# EAGLE schematic lh (EAGLE 6.4)
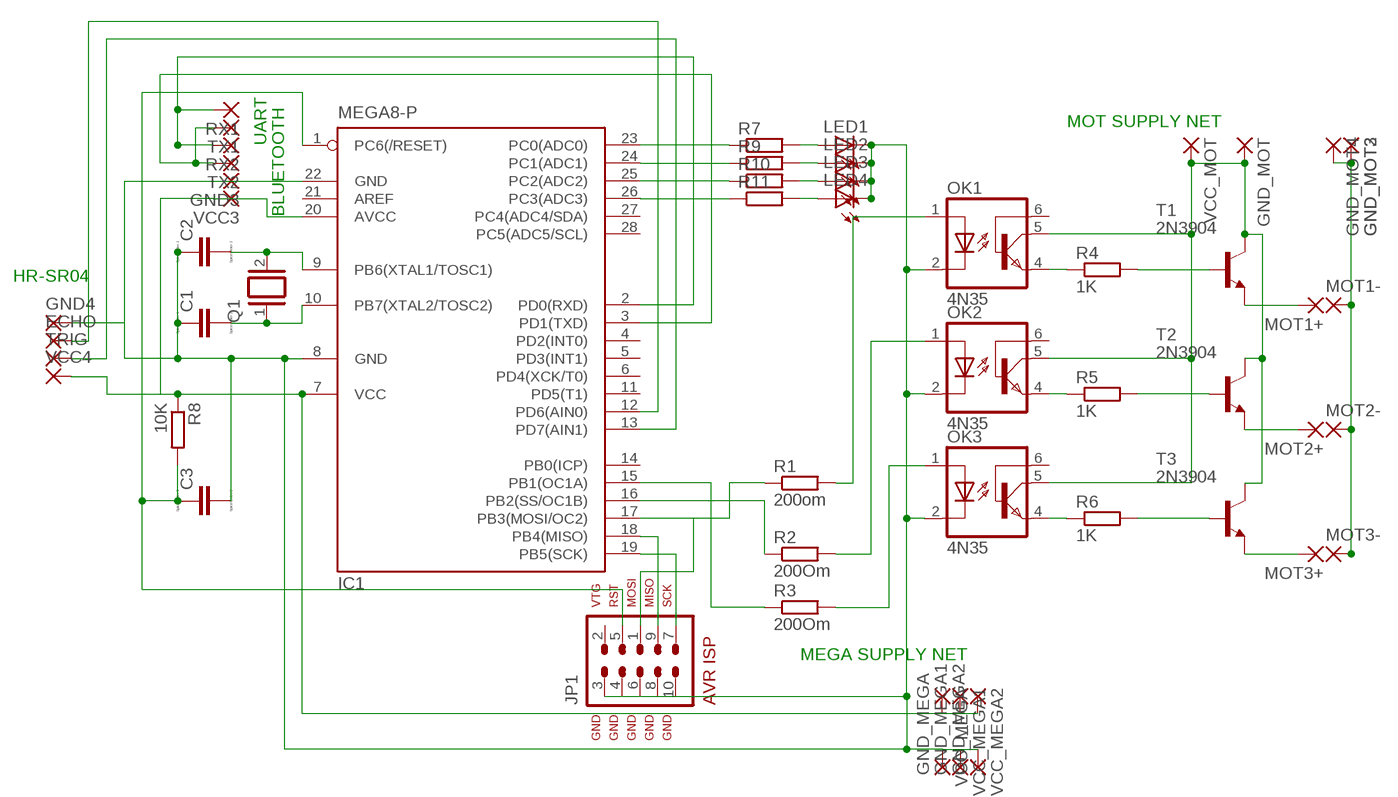
[diagram p0: schematic, sheet 1]

## Parts
C1  CC1206  [C1206]
C2  CC1206  [C1206]
C3  CC1206  [C1206]
ECHO  1,6/0,8  [1,6/0,8]
GND3  1,6/0,8  [1,6/0,8]
GND4  1,6/0,8  [1,6/0,8]
GND_MEGA  1,6/0,8  [1,6/0,8]
GND_MEGA1  1,6/0,8  [1,6/0,8]
GND_MEGA2  1,6/0,8  [1,6/0,8]
GND_MOT  1,6/0,8  [1,6/0,8]
GND_MOT2  1,6/0,8  [1,6/0,8]
GND_MOT3  1,6/0,8  [1,6/0,8]
GND_MOT4  1,6/0,8  [1,6/0,8]
IC1  MEGA8-P  [DIL28-3]
JP1  AVR-ISP-10  [AVR-ISP-10]
LED1  LEDSML0603  [SML0603]
LED2  LEDSML0603  [SML0603]
LED3  LEDSML0603  [SML0603]
LED4  LEDSML0603  [SML0603]
MOT1+  1,6/0,8  [1,6/0,8]
MOT1-  1,6/0,8  [1,6/0,8]
MOT2+  1,6/0,8  [1,6/0,8]
MOT2-  1,6/0,8  [1,6/0,8]
MOT3+  1,6/0,8  [1,6/0,8]
MOT3-  1,6/0,8  [1,6/0,8]
OK1  4N35  [DIL06]
OK2  4N35  [DIL06]
OK3  4N35  [DIL06]
Q1  XTAL/S  [QS]
R1  200om  R-EU_R0603  [R0603]
R2  200Om  R-EU_R0603  [R0603]
R3  200Om  R-EU_R0603  [R0603]
R4  1K  R-EU_R0603  [R0603]
R5  1K  R-EU_R0603  [R0603]
R6  1K  R-EU_R0603  [R0603]
R7  R-EU_R0603  [R0603]
R8  10K  R-EU_R0603  [R0603]
R9  R-EU_R0603  [R0603]
R10  R-EU_R0603  [R0603]
R11  R-EU_R0603  [R0603]
RX1  1,6/0,8  [1,6/0,8]
RX2  1,6/0,8  [1,6/0,8]
T1  2N3904  [TO92]
T2  2N3904  [TO92]
T3  2N3904  [TO92]
TRIG  1,6/0,8  [1,6/0,8]
TX1  1,6/0,8  [1,6/0,8]
TX2  1,6/0,8  [1,6/0,8]
VCC3  1,6/0,8  [1,6/0,8]
VCC4  1,6/0,8  [1,6/0,8]
VCC_MEGA  1,6/0,8  [1,6/0,8]
VCC_MEGA1  1,6/0,8  [1,6/0,8]
VCC_MEGA2  1,6/0,8  [1,6/0,8]
VCC_MOT  1,6/0,8  [1,6/0,8]

## Nets
MEGA_GND: C1.1 C2.1 C3.2 GND3.1(P) GND4.1(P) GND_MEGA1.1(P) GND_MEGA2.1(P) GND_MEGA.1(P) IC1.8(GND) IC1.22(GND) JP1.3 JP1.4 JP1.6 JP1.8 JP1.10 LED1.C LED2.C LED3.C LED4.C OK1.2(C) OK2.2(C) OK3.2(C)
MEGA_VCC: IC1.7(VCC) IC1.20(AVCC) R8.1 VCC3.1(P) VCC4.1(P) VCC_MEGA1.1(P) VCC_MEGA2.1(P) VCC_MEGA.1(P)
MOTO_GND: GND_MOT2.1(P) GND_MOT3.1(P) GND_MOT4.1(P) MOT1-.1(P) MOT2-.1(P) MOT3-.1(P)
MOTO_VCC: GND_MOT.1(P) OK1.5(COL) OK2.5(COL) OK3.5(COL) T1.1(C) T2.1(C) T3.1(C) VCC_MOT.1(P)
N$1: IC1.17(PB3(MOSI/OC2)) R1.1
N$2: IC1.16(PB2(SS/OC1B)) R2.1
N$3: JP1.1
N$4: OK1.1(A) R1.2
N$5: OK2.1(A) R2.2
N$6: OK3.1(A) R3.2
N$7: OK1.4(EMI) R4.1
N$8: OK2.4(EMI) R5.1
N$9: OK3.4(EMI) R6.1
N$10: R6.2 T3.2(B)
N$11: IC1.23(PC0(ADC0)) R7.1
N$13: MOT1+.1(P) T1.3(E)
N$14: MOT2+.1(P) T2.3(E)
N$15: MOT3+.1(P) T3.3(E)
N$16: C2.2 IC1.9(PB6(XTAL1/TOSC1)) Q1.2
N$17: C1.2 IC1.10(PB7(XTAL2/TOSC2)) Q1.1
N$18: IC1.19(PB5(SCK)) JP1.7
N$19: IC1.18(PB4(MISO)) JP1.9
N$20: R4.2 T1.2(B)
N$21: IC1.13(PD7(AIN1)) TRIG.1(P)
N$22: ECHO.1(P) IC1.12(PD6(AIN0))
N$23: IC1.2(PD0(RXD)) RX1.1(P) RX2.1(P)
N$24: IC1.3(PD1(TXD)) TX1.1(P) TX2.1(P)
N$25: R5.2 T2.2(B)
N$26: IC1.24(PC1(ADC1)) R9.1
N$27: IC1.25(PC2(ADC2)) R10.1
N$28: IC1.26(PC3(ADC3)) R11.1
N$30: C3.1 IC1.1(PC6(/RESET)) JP1.5 R8.2
N$31: LED1.A R7.2
N$32: LED2.A R9.2
N$33: LED3.A R10.2
N$34: LED4.A R11.2
N$36: IC1.15(PB1(OC1A)) R3.1
Unconnected: IC1.4(PD2(INT0)) IC1.5(PD3(INT1)) IC1.6(PD4(XCK/T0)) IC1.11(PD5(T1)) IC1.14(PB0(ICP)) IC1.21(AREF) IC1.27(PC4(ADC4/SDA)) IC1.28(PC5(ADC5/SCL)) JP1.2 OK1.6(BAS) OK2.6(BAS) OK3.6(BAS)

## Notes on the sheet
- MOT SUPPLY NET
- UART
- BLUETOOTH
- HR-SR04
- MEGA SUPPLY NET

## Library data of the parts
C1-C3 = eagle-ltspice:C: CAPACITOR, European symbol; SPICEMODEL: NONE; SPICEPREFIX: C
ECHO GND3 GND4 GND_MEGA GND_MEGA1 GND_MEGA2 GND_MOT GND_MOT2-GND_MOT4 MOT1+ MOT1- MOT2+ MOT2- MOT3+ MOT3- RX1 RX2 TRIG TX1 TX2 VCC3 VCC4 VCC_MEGA VCC_MEGA1 VCC_MEGA2 VCC_MOT = wirepad:1,6/0,8: THROUGH-HOLE PAD
IC1 = atmel:MEGA8-P: MICROCONTROLLER 8 Kbytes FLASH, 1 kbytes SRAM, 512 bytes EEPROM, USART, 4-channel 10 bit ADC, 2-channel 8 bit ADC Pin compatible with Atmega48, ATMega88, ATMega168 Source: avr.lbr; OC_FARNELL: unknown; OC_NEWARK: unknown
JP1 = avr-5:AVR-ISP-10: AVR ISP-10 Serial Programming Header
LED1-LED4 = led:LED: LED OSRAM: - CHIPLED LG R971, LG N971, LY N971, LG Q971, LY Q971, LO R971, LY R971 LH N974, LH R974 LS Q976, LO Q976, LY Q976 LO Q996 - Hyper CHIPLED LW Q18S LB Q993, LB Q99A, LB R99A - SideLED LS A670, LO A670, LY A670, LG A670, LP A670 LB A673, LV A673, LT A673, LW A673 LH A674 LY A675 LS A676, LA A676, LO A676, LY A676, LW A676 LS A679, LY A679, LG A679 - Hyper Micro SIDELED® LS Y876, LA Y876, LO Y876, LY Y876 LT Y87S - SmartLED LW L88C, LW L88S LB L89C, LB L89S, LG L890 LS L89K, LO L89K, LY L89K LS L896, LA L896, LO L896, LY L896 - TOPLED LS T670, LO T670, LY T670, LG T670, LP T670 LSG T670, LSP T670, LSY T670, LOP T670, LYG T670 LG T671, LOG T671, LSG T671 LB T673, LV T673, LT T673, LW T673 LH T674 LS T676, LA T676, LO T676, LY T676, LB T676, LH T676, LSB T676, LW T676 LB T67C, LV T67C, LT T67C, LS T67K, LO T67K, LY T67K, LW E67C LS E67B, LA E67B, LO E67B, LY E67B, LB E67C, LV E67C, LT E67C LW T67C LS T679, LY T679, LG T679 LS T770, LO T770, LY T770, LG T770, LP T770 LB T773, LV T773, LT T773, LW T773 LH T774 LS E675, LA E675, LY E675, LS T675 LS T776, LA T776, LO T776, LY T776, LB T776 LHGB T686 LT T68C, LB T68C - Hyper Mini TOPLED® LB M676 - Mini TOPLED Santana® LG M470 LS M47K, LO M47K, LY M47K Source: http://www.osram.convergy.de LUXEON: - LUMILED® LXK2-PW12-R00, LXK2-PW12-S00, LXK2-PW14-U00, LXK2-PW14-V00 LXK2-PM12-R00, LXK2-PM12-S00, LXK2-PM14-U00 LXK2-PE12-Q00, LXK2-PE12-R00, LXK2-PE12-S00, LXK2-PE14-T00, LXK2-PE14-U00 LXK2-PB12-K00, LXK2-PB12-L00, LXK2-PB12-M00, LXK2-PB14-N00, LXK2-PB14-P00, LXK2-PB14-Q00 LXK2-PR12-L00, LXK2-PR12-M00, LXK2-PR14-Q00, LXK2-PR14-R00 LXK2-PD12-Q00, LXK2-PD12-R00, LXK2-PD12-S00 LXK2-PH12-R00, LXK2-PH12-S00 LXK2-PL12-P00, LXK2-PL12-Q00, LXK2-PL12-R00 Source: www.luxeon.com KINGBRIGHT: KA-3528ASYC Source: www.kingbright.com
OK1-OK3 = optocoupler:4N35: MOTOROLA OPTO COUPLER; MF: FAIRCHILD SEMICONDUCTOR; MPN: 4N35; OC_FARNELL: 1328375; OC_NEWARK: 72K9946
Q1 = special:XTAL/S: CRYSTAL
R1-R11 = rcl:R-EU_: RESISTOR, European symbol
T1-T3 = transistor:2N3904: NPN TRANSISTOR